# EasyEDA Pro project EasyEDA NeuroHab Core Project.epro

# Schematic Relay Schem
Create Date: 2026-04-01; Page Name: P1; Project Name: NH-AI CORE; Schematic Name: Relay Schem; Update Date: 2026-04-01; Company: EasyEDA.com; Page Size: A4; Version: V1.0
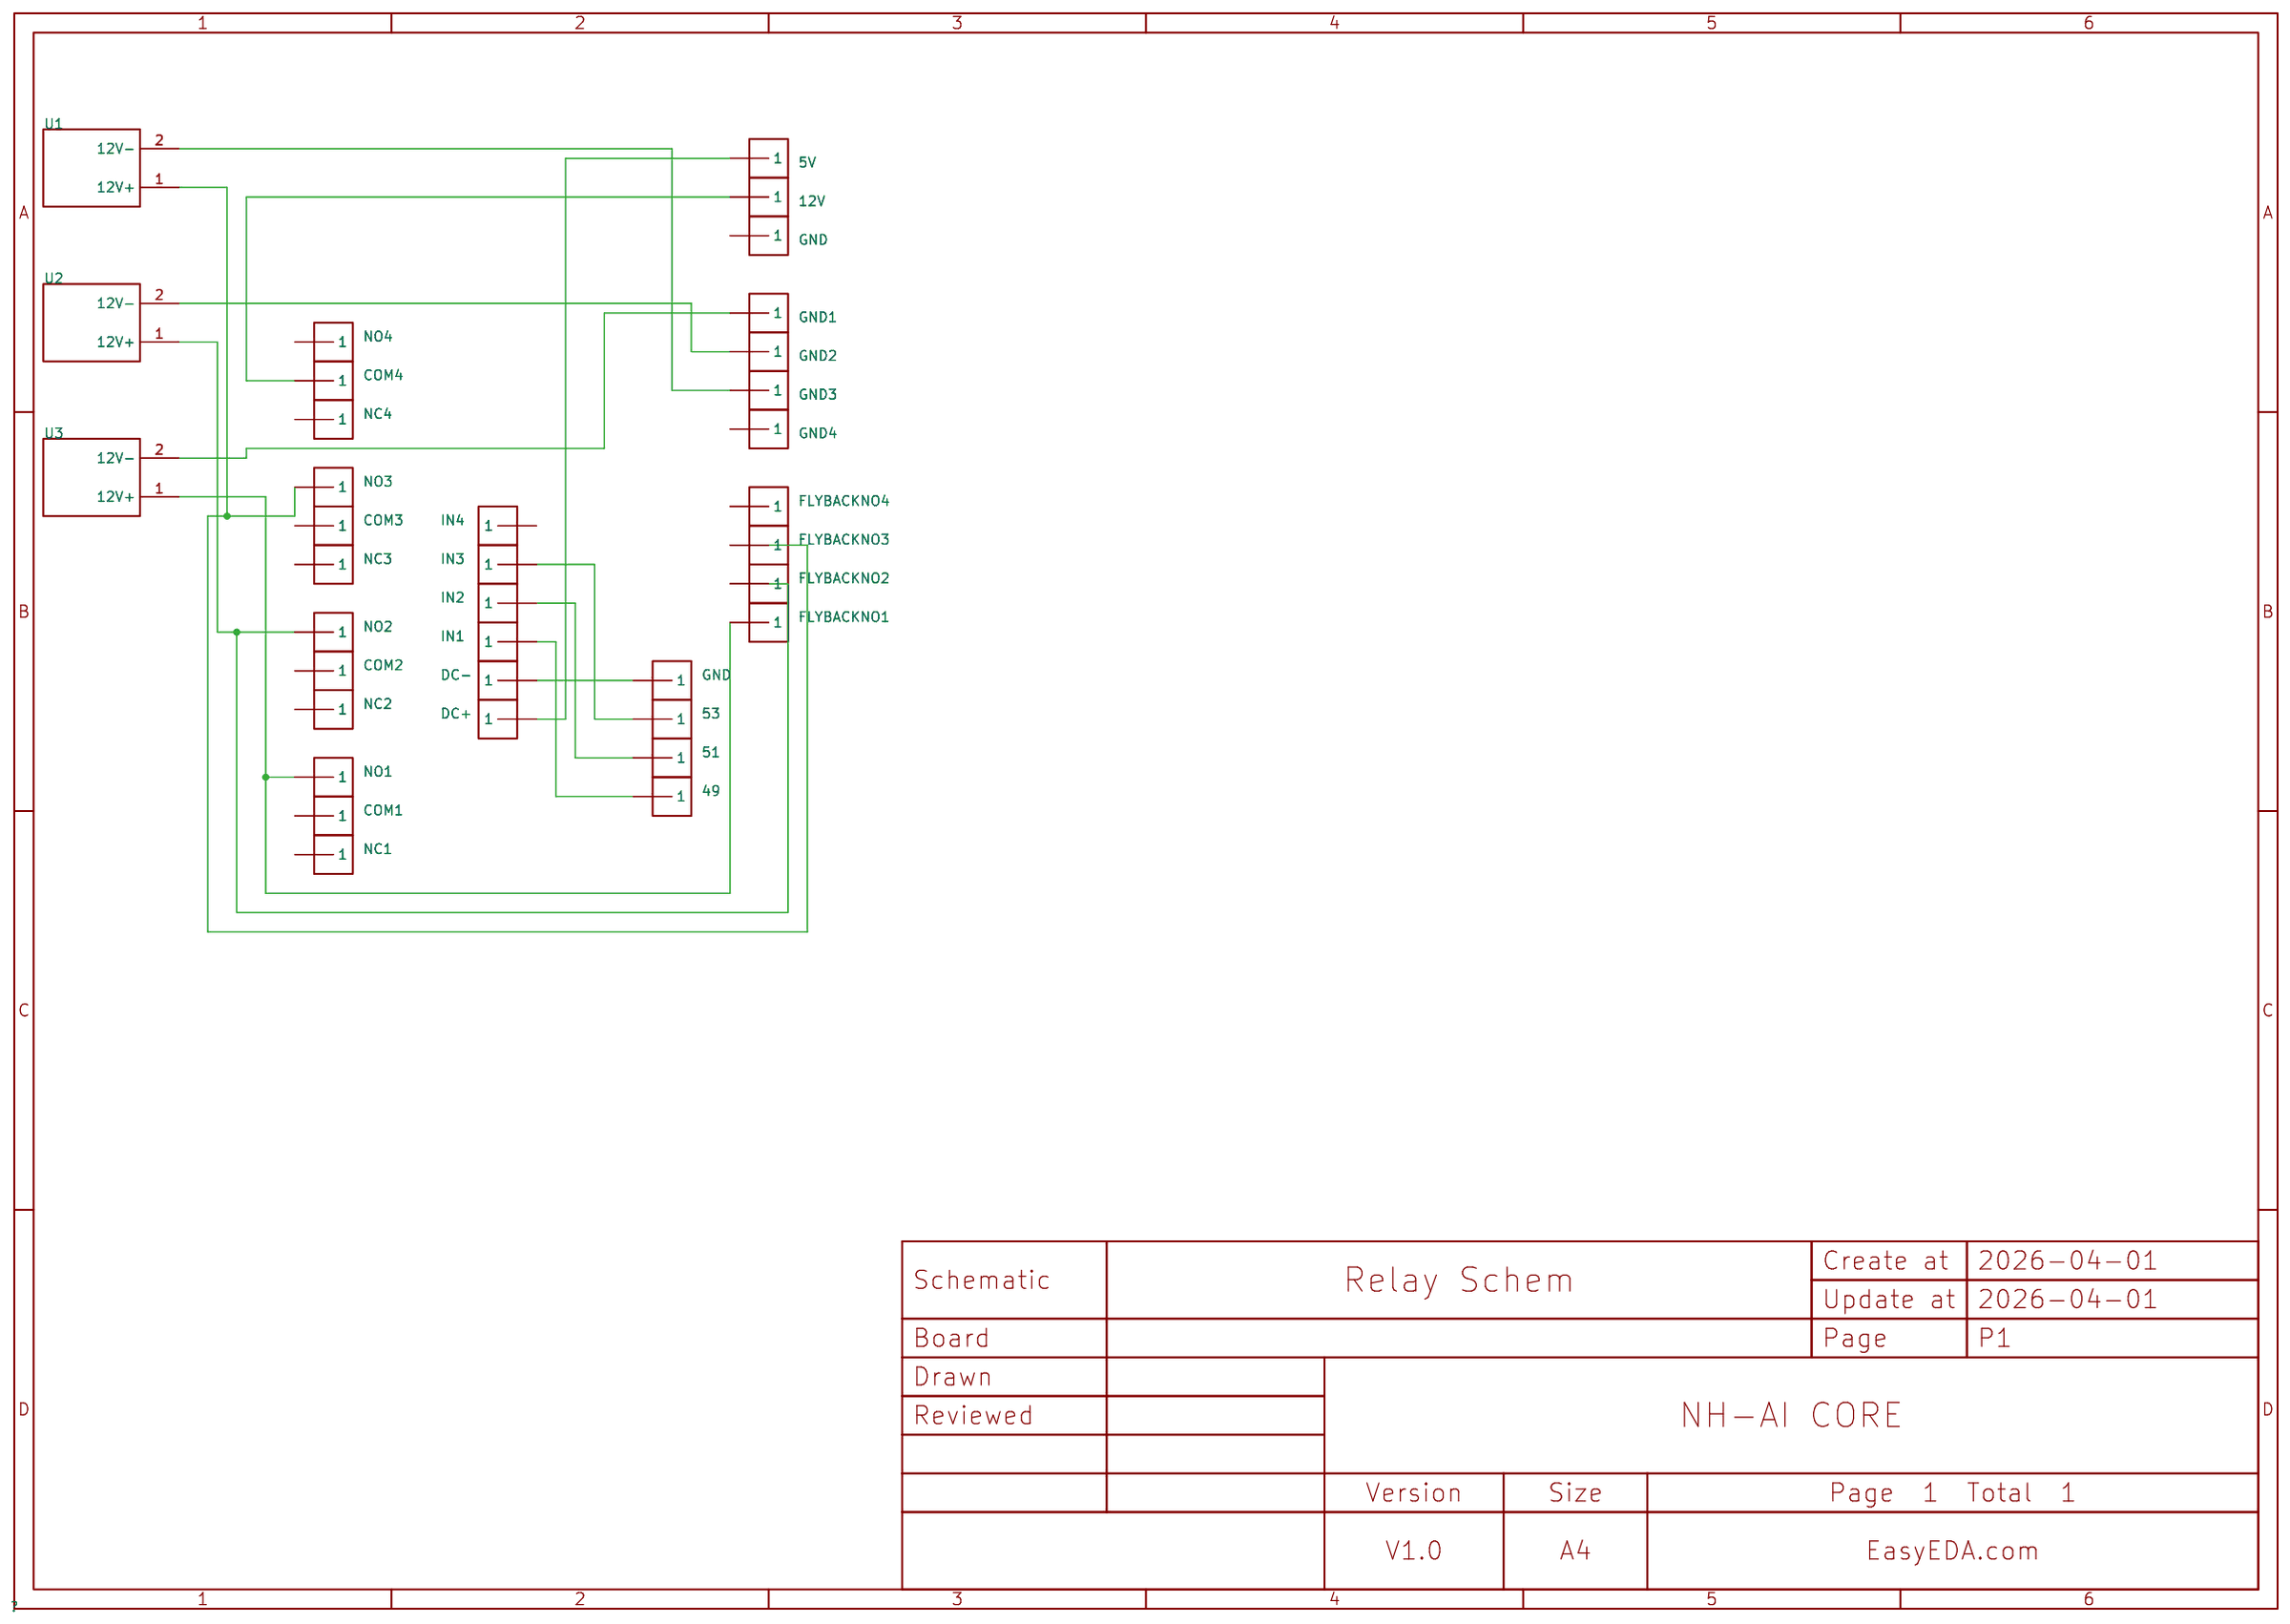
[diagram p0: schematic sheet]

## Parts
5V  -  [2.54mm Screw Terminal]
12V  -  [2.54mm Screw Terminal]
49  -  [2.54mm Screw Terminal]
51  -  [2.54mm Screw Terminal]
53  -  [2.54mm Screw Terminal]
COM1  -  [2.54mm Screw Terminal]
COM2  -  [2.54mm Screw Terminal]
COM3  -  [2.54mm Screw Terminal]
COM4  -  [2.54mm Screw Terminal]
DC+  -  [2.54mm Screw Terminal]
DC-  -  [2.54mm Screw Terminal]
FLYBACKNO1  -  [2.54mm Screw Terminal]
FLYBACKNO2  -  [2.54mm Screw Terminal]
FLYBACKNO3  -  [2.54mm Screw Terminal]
FLYBACKNO4  -  [2.54mm Screw Terminal]
GND  -  [2.54mm Screw Terminal]
GND1  -  [2.54mm Screw Terminal]
GND2  -  [2.54mm Screw Terminal]
GND3  -  [2.54mm Screw Terminal]
GND4  -  [2.54mm Screw Terminal]
GND#2  -  [2.54mm Screw Terminal]
IN1  -  [2.54mm Screw Terminal]
IN2  -  [2.54mm Screw Terminal]
IN3  -  [2.54mm Screw Terminal]
IN4  -  [2.54mm Screw Terminal]
NC1  -  [2.54mm Screw Terminal]
NC2  -  [2.54mm Screw Terminal]
NC3  -  [2.54mm Screw Terminal]
NC4  -  [2.54mm Screw Terminal]
NO1  -  [2.54mm Screw Terminal]
NO2  -  [2.54mm Screw Terminal]
NO3  -  [2.54mm Screw Terminal]
NO4  -  [2.54mm Screw Terminal]
U1  -
U2  -
U3  -

## Library data of the parts
5V 12V 49 51 53 COM1-COM4 DC+ DC- FLYBACKNO1-FLYBACKNO4 GND GND1-GND4 GND#2 IN1-IN4 NC1-NC4 NO1-NO4 = 2.54mm Screw Terminal Block
U1-U3 = 12V Solenoid Valve: +- terminals for 12V solenoid valve.

## Nets
Net-(5V-1): 5V.1 DC+.1
Net-(12V-1): 12V.1 COM4.1
Net-(49-1): 49.1 IN1.1
Net-(51-1): 51.1 IN2.1
Net-(53-1): 53.1 IN3.1
Net-(DC--1): DC-.1 GND.1
Net-(FLYBACKNO1-1): FLYBACKNO1.1 NO1.1 U3.1(12V+)
Net-(FLYBACKNO2-1): FLYBACKNO2.1 NO2.1 U2.1(12V+)
Net-(FLYBACKNO3-1): FLYBACKNO3.1 NO3.1 U1.1(12V+)
Net-(GND1-1): GND1.1 U3.2(12V-)
Net-(GND2-1): GND2.1 U2.2(12V-)
Net-(GND3-1): GND3.1 U1.2(12V-)

Not connected (* = marked no-connect by the designer): COM1 1; COM2 1; COM3 1; FLYBACKNO4 1; GND4 1; GND#2 1; IN4 1; NC1 1; NC2 1; NC3 1; NC4 1; NO4 1

# Board PCB1
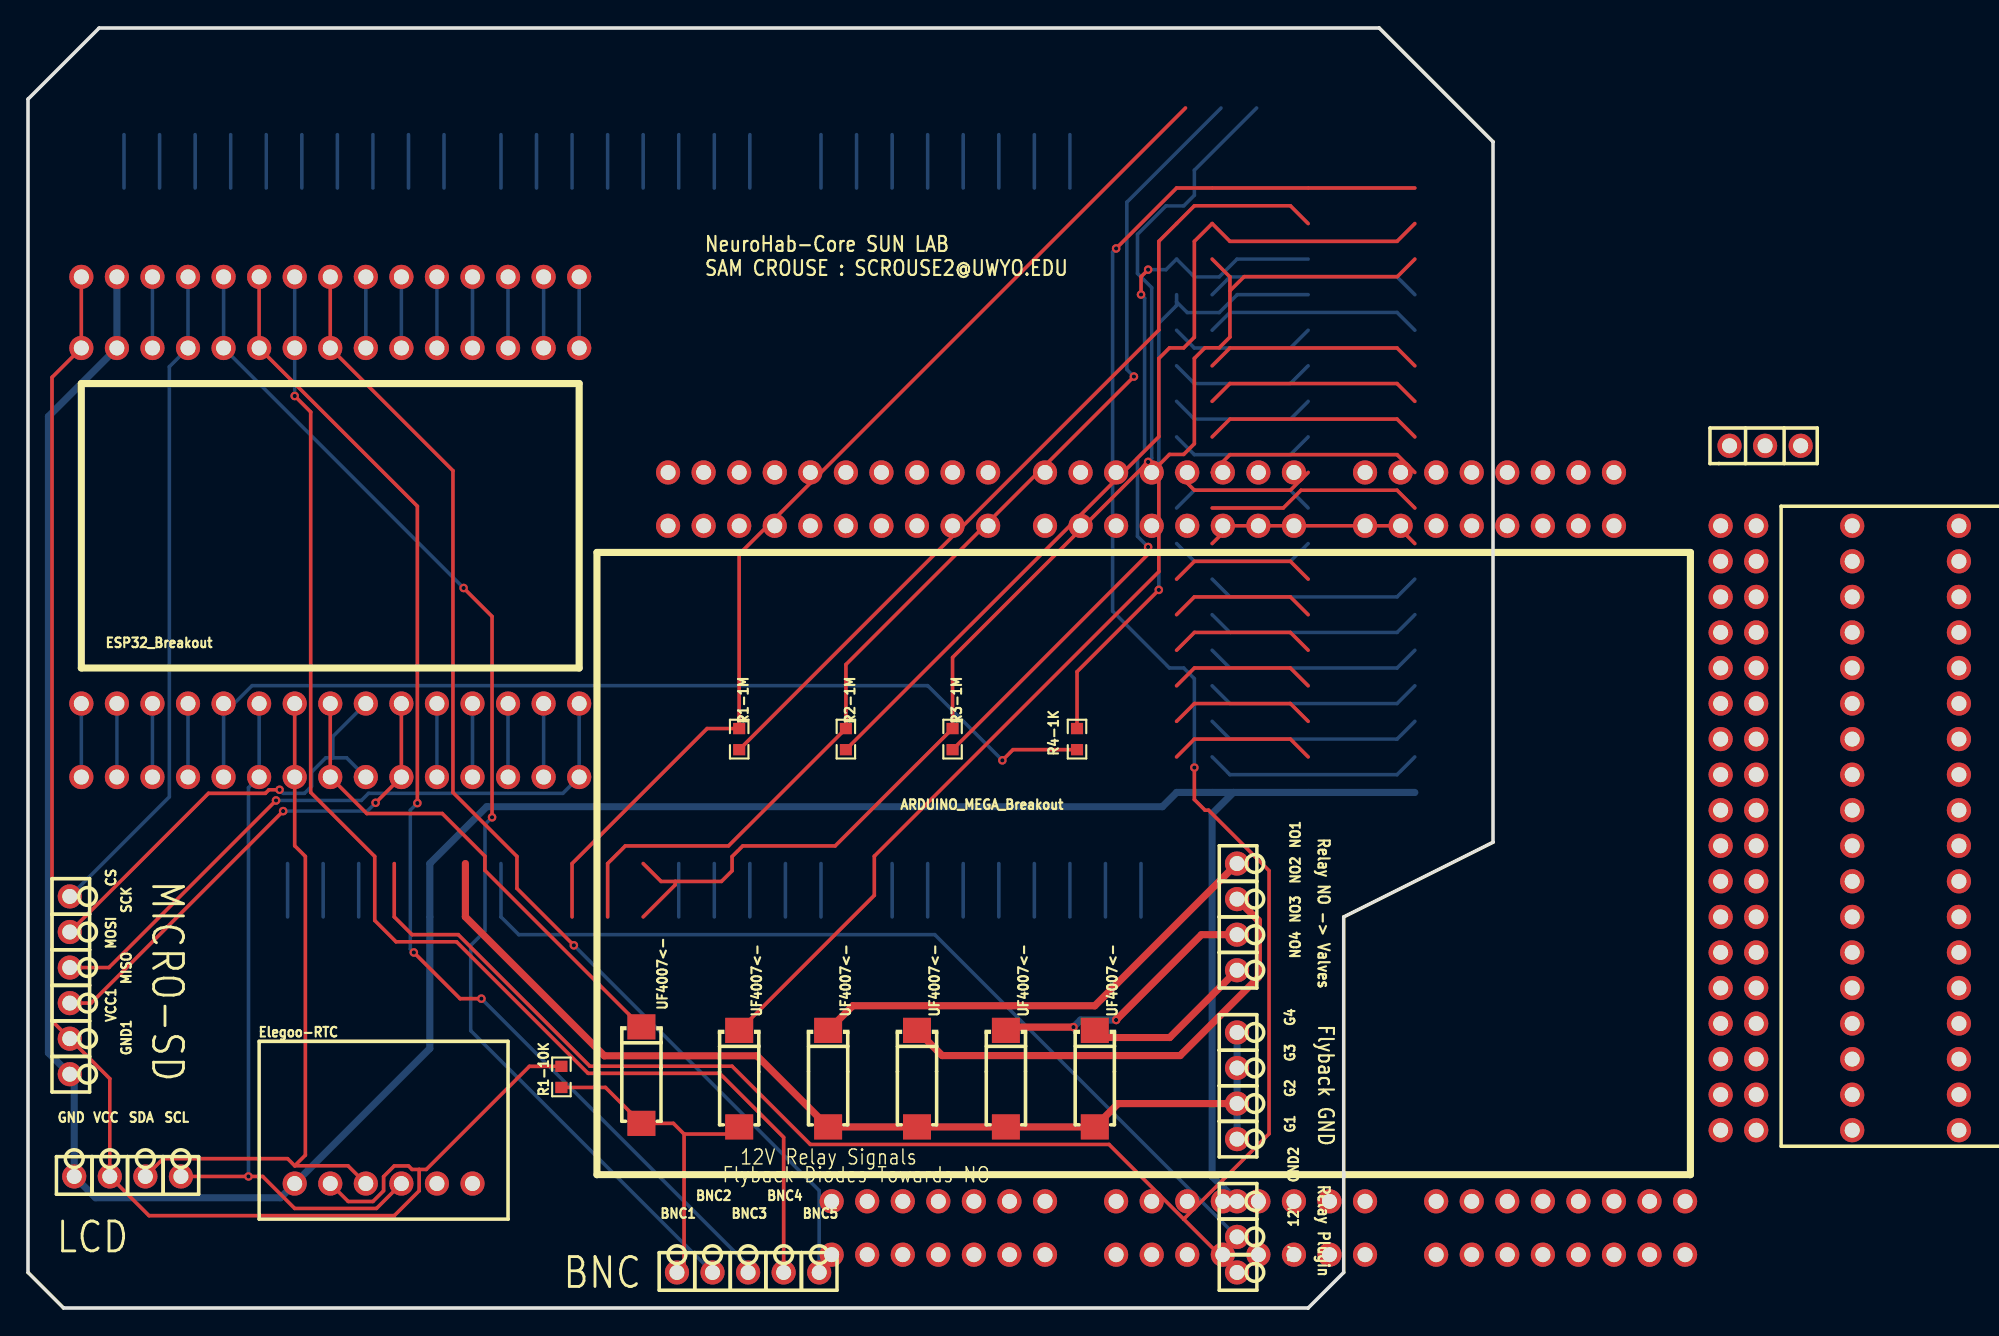
[diagram p1: board, top side]
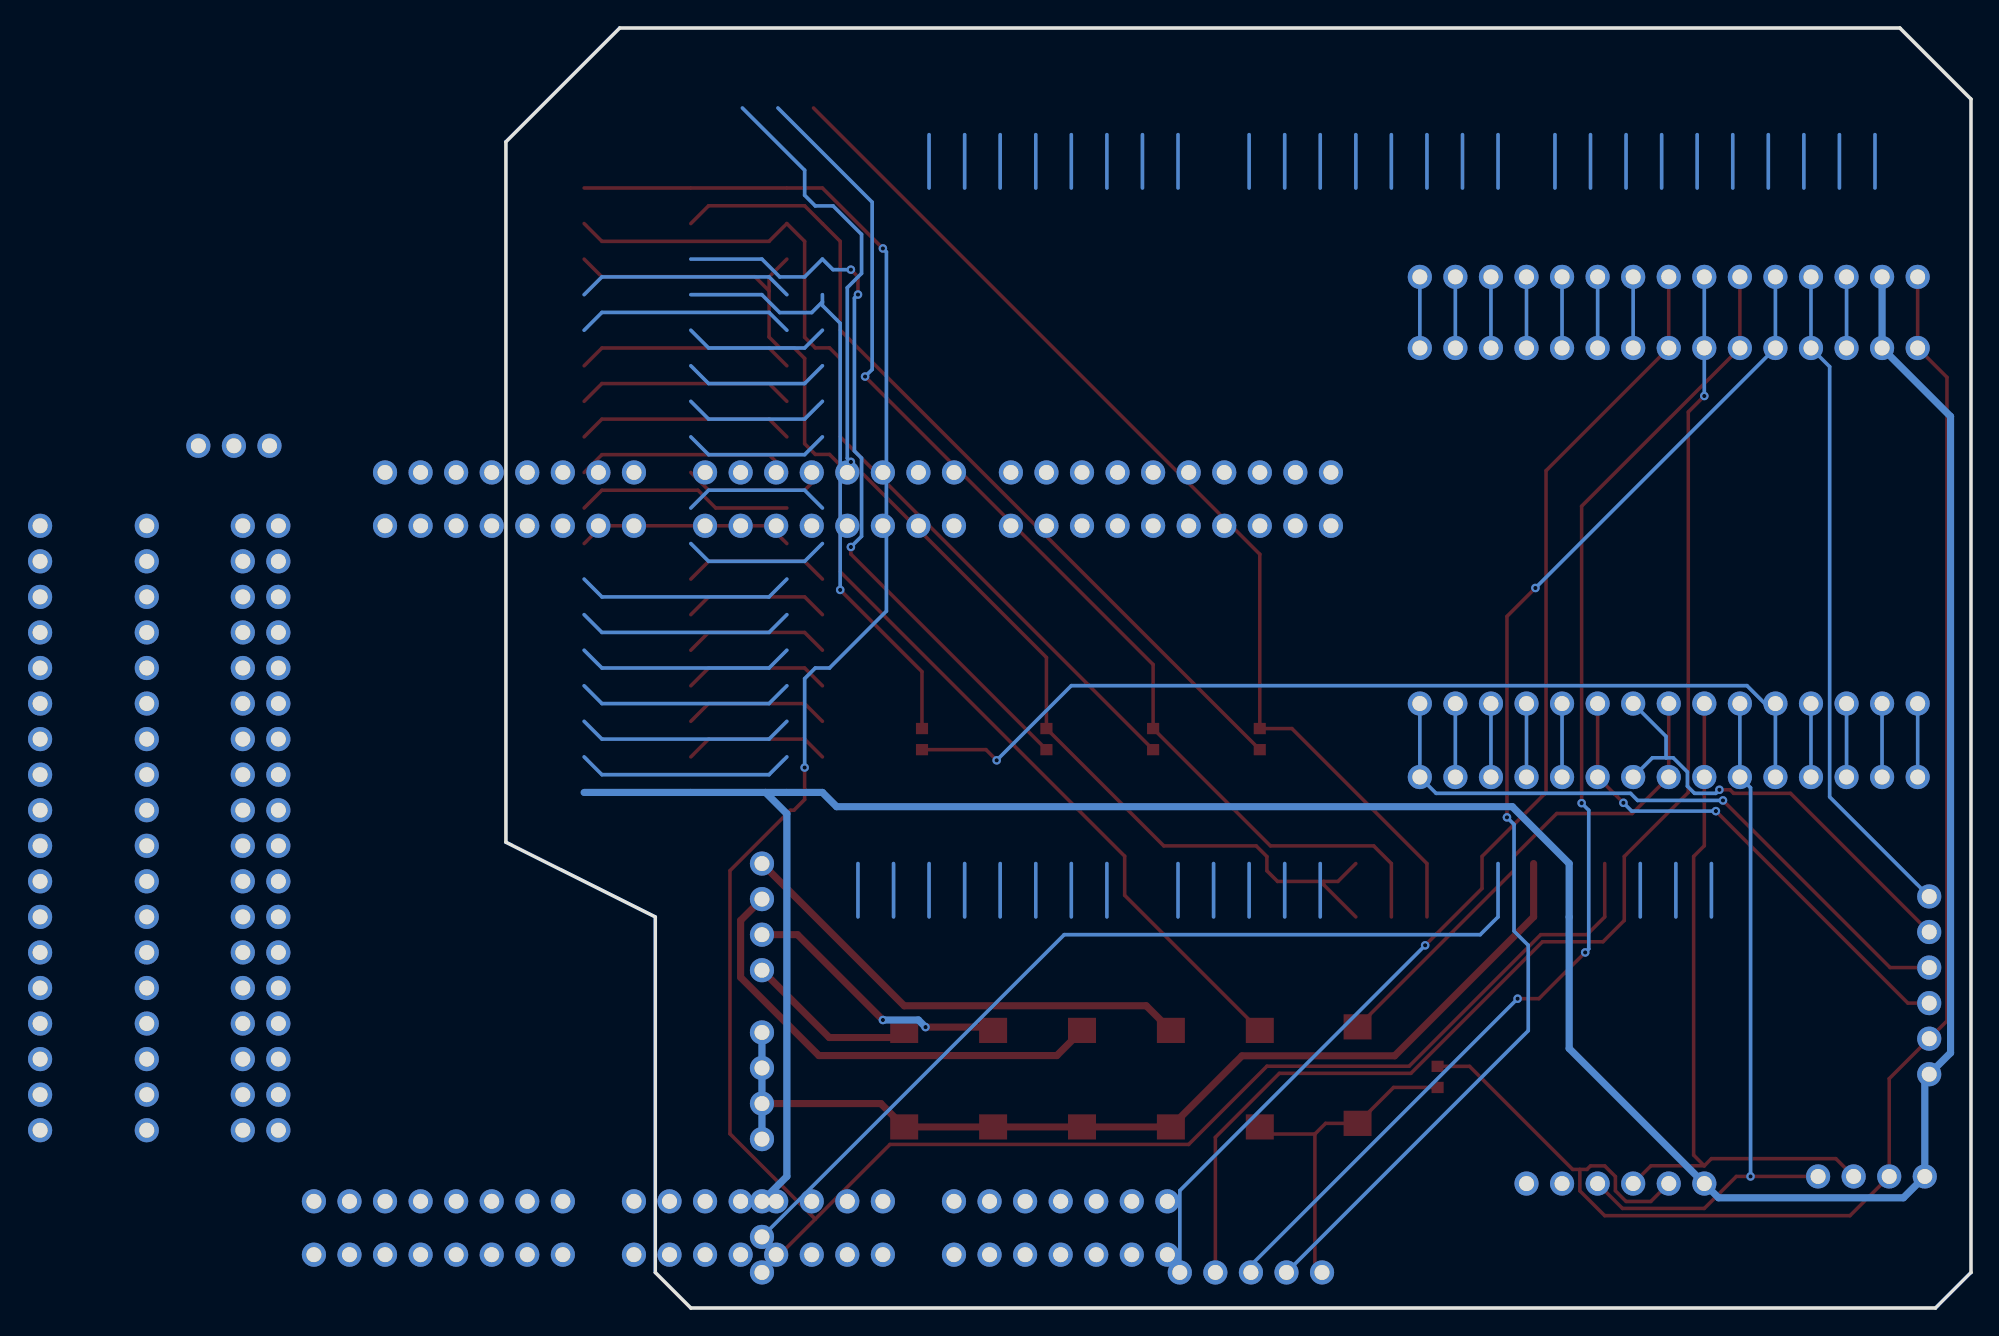
[diagram p2: board, bottom side, seen from below]

Outline 104.65 x 91.44 mm; copper layers: Top Layer, Bottom Layer. Coordinates in mm from the lower left corner of the outline.
Outline path: 0,86.36 0,2.54 2.54,0 91.44,0 93.98,2.54 93.98,27.94 104.65,33.27 104.65,83.31 96.52,91.44 5.08,91.44 0,86.36
Stack: Top Layer 0.035mm / Dielectric1 1.51mm FR4 er 4.5 / Bottom Layer 0.035mm

## Design rules (mm)
spacing copperThickness1oz (default): track to track 0.102, other pairs 0.152 to 0.3
spacing copperThickness2oz: track to track 0.203, other pairs 0.152 to 0.3
spacing Plane_innerPlane: track to track 0.102, other pairs 0.152 to 0.3
spacing Copper_copperRegion: track to track 0.102, other pairs 0.152 to 0.3
track width copperThickness1oz (default): min 0.127, default 0.254, max 2.54
track width copperThickness2oz: min 0.203, default 0.508, max 2.54
differential pair differentialPair (default): width min 0.127, default 0.254, max 2.54; gap min 0.152, default 0.152
net GND uses copperThickness2oz
net $1N12935 uses copperThickness2oz
net $1N12948 uses copperThickness2oz
net $1N12959 uses copperThickness2oz
net $1N13064 uses copperThickness2oz
net GND2 uses copperThickness2oz

## Placement (name value [footprint] x y rotation side)
5V  -  [2.54mm Screw Terminal]  86.36 2.54 270 top
12V  -  [2.54mm Screw Terminal]  86.36 5.08 270 top
ARDUINO_MEGA_Breakout  -  [Arduino Mega 2560 Breakout]  45.72 55.88 0 top
BNC1  -  [2.54mm Screw Terminal]  46.36 2.54 0 top
BNC2  -  [2.54mm Screw Terminal]  48.89 2.54 0 top
BNC3  -  [2.54mm Screw Terminal]  51.43 2.54 0 top
BNC4  -  [2.54mm Screw Terminal]  53.98 2.54 0 top
BNC5  -  [2.54mm Screw Terminal]  56.52 2.54 0 top
CS  -  [2.54mm Screw Terminal]  2.98 29.4 270 top
Elegoo-RTC  -  [Elegoo RTC DS1307]  19.05 8.89 0 top
ESP32_Breakout  -  [ESP32 Breakout]  3.81 68.58 0 top
G1  -  [2.54mm Screw Terminal]  86.36 12.06 270 top
G2  -  [2.54mm Screw Terminal]  86.36 14.6 270 top
G3  -  [2.54mm Screw Terminal]  86.36 17.14 270 top
G4  -  [2.54mm Screw Terminal]  86.36 19.69 270 top
GND  -  [2.54mm Screw Terminal]  3.3 9.4 0 top
GND1  -  [2.54mm Screw Terminal]  2.98 16.7 270 top
GND2  -  [2.54mm Screw Terminal]  86.36 7.62 270 top
MISO  -  [2.54mm Screw Terminal]  2.98 21.78 270 top
MOSI  -  [2.54mm Screw Terminal]  2.98 24.32 270 top
NO1  -  [2.54mm Screw Terminal]  86.36 31.75 270 top
NO2  -  [2.54mm Screw Terminal]  86.36 29.21 270 top
NO3  -  [2.54mm Screw Terminal]  86.36 26.67 270 top
NO4  -  [2.54mm Screw Terminal]  86.36 24.13 270 top
R1-1M  1MΩ  [R0603]  50.8 40.64 270 top
R1-10K  10K  [R0603]  38.1 16.51 90 top
R2-1M  1MΩ  [R0603]  58.42 40.64 270 top
R3-1M  1MΩ  [R0603]  66.04 40.64 270 top
R4-1K  1K  [R0603]  74.93 40.64 270 top
SCK  -  [2.54mm Screw Terminal]  2.98 26.86 270 top
SCL  -  [2.54mm Screw Terminal]  10.92 9.4 0 top
SDA  -  [2.54mm Screw Terminal]  8.38 9.4 0 top
UF4007<-  -  [SMAF_L3.5-W2.6-LS4.6-RD]  43.82 18.03 270 top
UF4007<-#2  -  [SMAF_L3.5-W2.6-LS4.6-RD]  50.8 17.78 270 top
UF4007<-#3  -  [SMAF_L3.5-W2.6-LS4.6-RD]  69.85 17.78 270 top
UF4007<-#4  -  [SMAF_L3.5-W2.6-LS4.6-RD]  63.5 17.78 270 top
UF4007<-#5  -  [SMAF_L3.5-W2.6-LS4.6-RD]  57.15 17.78 270 top
UF4007<-#6  -  [SMAF_L3.5-W2.6-LS4.6-RD]  76.2 17.78 270 top
VCC  -  [2.54mm Screw Terminal]  5.84 9.4 0 top
VCC1  -  [2.54mm Screw Terminal]  2.98 19.24 270 top

## Footprints (pads in the part's own frame, mm; a bottom-side part is the same pattern mirrored in y, then rotated)
2.54mm Screw Terminal
  round 1.727 hole 1.067: 1(0,0)
Arduino Mega 2560 Breakout
  round 1.727 hole 1.067: 1(0,0) 2(2.54,0) 3(5.08,0) 4(7.62,0) 5(10.16,0) 6(12.7,0) 7(15.24,0) 8(17.78,0) 9(20.32,0) 10(22.86,0) 11(26.924,0) 12(29.464,0) 13(32.004,0) 14(34.544,0) 15(37.084,0) 16(39.624,0) 17(42.164,0) 18(44.704,0) 19(49.784,0) 20(52.324,0) 21(54.864,0) 22(57.404,0) 23(59.944,0) 24(62.484,0) 25(65.024,0) 26(67.564,0) 27(75.184,0) 28(77.724,0) 29(75.184,-2.54) 30(77.724,-2.54) 31(75.184,-5.08) 32(77.724,-5.08) 33(75.184,-7.62) 34(77.724,-7.62) 35(75.184,-10.16) 36(77.724,-10.16) 37(75.184,-12.7) 38(77.724,-12.7) 39(75.184,-15.24) 40(77.724,-15.24) 41(75.184,-17.78) 42(77.724,-17.78) 43(75.184,-20.32) 44(77.724,-20.32) 45(75.184,-22.86) 46(77.724,-22.86) 47(75.184,-25.4) 48(77.724,-25.4) 49(75.184,-27.94) 50(77.724,-27.94) 51(75.184,-30.48) 52(77.724,-30.48) 53(75.184,-33.02) 54(77.724,-33.02) 55(75.184,-35.56) 56(77.724,-35.56) 57(75.184,-38.1) 58(77.724,-38.1) 59(75.184,-40.64) 60(77.724,-40.64) 61(75.184,-43.18) 62(77.724,-43.18) 63(72.644,-48.26) 64(70.104,-48.26) 65(67.564,-48.26) 66(65.024,-48.26) 67(62.484,-48.26) 68(59.944,-48.26) 69(57.404,-48.26) 70(54.864,-48.26) 71(49.784,-48.26) 72(47.244,-48.26) 73(44.704,-48.26) 74(42.164,-48.26) 75(39.624,-48.26) 76(37.084,-48.26) 77(34.544,-48.26) 78(32.004,-48.26) 79(26.924,-48.26) 80(24.384,-48.26) 81(21.844,-48.26) 82(19.304,-48.26) 83(16.764,-48.26) 84(14.224,-48.26) 85(11.684,-48.26) 86(75.819,5.715) 87(78.359,5.715) 88(80.899,5.715) 89(84.582,0) 90(84.582,-2.54) 91(84.582,-5.08) 92(84.582,-7.62) 93(84.582,-10.16) 94(84.582,-12.7) 95(84.582,-15.24) 96(84.582,-17.78) 97(84.582,-20.32) 98(84.582,-22.86) 99(84.582,-25.4) 100(84.582,-27.94) 101(84.582,-30.48) 102(84.582,-33.02) 103(84.582,-35.56) 104(84.582,-38.1) 105(84.582,-40.64) 106(84.582,-43.18) 107(92.202,0) 108(92.202,-2.54) 109(92.202,-5.08) 110(92.202,-7.62) 111(92.202,-10.16) 112(92.202,-12.7) 113(92.202,-15.24) 114(92.202,-17.78) 115(92.202,-20.32) 116(92.202,-22.86) 117(92.202,-25.4) 118(92.202,-27.94) 119(92.202,-30.48) 120(92.202,-33.02) 121(92.202,-35.56) 122(92.202,-38.1) 123(92.202,-40.64) 124(92.202,-43.18) 125(0,3.81) 126(2.54,3.81) 127(5.08,3.81) 128(7.62,3.81) 129(10.16,3.81) 130(12.7,3.81) 131(15.24,3.81) 132(17.78,3.81) 133(20.32,3.81) 134(22.86,3.81) 135(26.924,3.81) 136(29.464,3.81) 137(32.004,3.81) 138(34.544,3.81) 139(37.084,3.81) 140(39.624,3.81) 141(42.164,3.81) 142(44.704,3.81) 143(49.784,3.81) 144(52.324,3.81) 145(54.864,3.81) 146(57.404,3.81) 147(59.944,3.81) 148(62.484,3.81) 149(65.024,3.81) 150(67.564,3.81) 151(72.644,-52.07) 152(70.104,-52.07) 153(67.564,-52.07) 154(65.024,-52.07) 155(62.484,-52.07) 156(59.944,-52.07) 157(57.404,-52.07) 158(54.864,-52.07) 159(49.784,-52.07) 160(47.244,-52.07) 161(44.704,-52.07) 162(42.164,-52.07) 163(39.624,-52.07) 164(37.084,-52.07) 165(34.544,-52.07) 166(32.004,-52.07) 167(26.924,-52.07) 168(24.384,-52.07) 169(21.844,-52.07) 170(19.304,-52.07) 171(16.764,-52.07) 172(14.224,-52.07) 173(11.684,-52.07)
Elegoo RTC DS1307
  round 1.727 hole 1.067: 1(0,0) 2(2.54,0) 3(5.08,0) 4(7.62,0) 5(10.16,0) 6(12.7,0)
ESP32 Breakout
  round 1.727 hole 1.067: 1(0,0) 2(2.54,0) 3(5.08,0) 4(7.62,0) 5(10.16,0) 6(12.7,0) 7(15.24,0) 8(17.78,0) 9(20.32,0) 10(22.86,0) 11(25.4,0) 12(27.94,0) 13(30.48,0) 14(33.02,0) 15(35.56,0) 16(0,-25.4) 17(2.54,-25.4) 18(5.08,-25.4) 19(7.62,-25.4) 20(10.16,-25.4) 21(12.7,-25.4) 22(15.24,-25.4) 23(17.78,-25.4) 24(20.32,-25.4) 25(22.86,-25.4) 26(25.4,-25.4) 27(27.94,-25.4) 28(30.48,-25.4) 29(33.02,-25.4) 30(35.56,-25.4) 31(0,5.08) 32(2.54,5.08) 33(5.08,5.08) 34(7.62,5.08) 35(10.16,5.08) 36(12.7,5.08) 37(15.24,5.08) 38(17.78,5.08) 39(20.32,5.08) 40(22.86,5.08) 41(25.4,5.08) 42(27.94,5.08) 43(30.48,5.08) 44(33.02,5.08) 45(35.56,5.08) 46(0,-30.649) 47(2.54,-30.649) 48(5.08,-30.649) 49(7.62,-30.649) 50(10.16,-30.649) 51(12.7,-30.649) 52(15.24,-30.649) 53(17.78,-30.649) 54(20.32,-30.649) 55(22.86,-30.649) 56(25.4,-30.649) 57(27.94,-30.649) 58(30.48,-30.649) 59(33.02,-30.649) 60(35.56,-30.649)
R0603
  rect 0.806x0.864 smd: 1(-0.753,0) 2(0.753,0)
SMAF_L3.5-W2.6-LS4.6-RD
  rect 1.8x2 smd: 1(-2.05,0) 2(4.844,0)

## Nets
5V: 5V.1 ARDUINO_MEGA_Breakout.27 ARDUINO_MEGA_Breakout.28 ARDUINO_MEGA_Breakout.82 ARDUINO_MEGA_Breakout.89 ARDUINO_MEGA_Breakout.107 ARDUINO_MEGA_Breakout.170
GND: ARDUINO_MEGA_Breakout.61 ARDUINO_MEGA_Breakout.62 ARDUINO_MEGA_Breakout.81 ARDUINO_MEGA_Breakout.106 ARDUINO_MEGA_Breakout.124 ARDUINO_MEGA_Breakout.169 Elegoo-RTC.1 ESP32_Breakout.2 ESP32_Breakout.32 GND.1 GND1.1 GND2.1
GND2: ARDUINO_MEGA_Breakout.80 ARDUINO_MEGA_Breakout.168 G1.1 G2.1 G3.1 G4.1 UF4007<-#3.2 UF4007<-#4.2 UF4007<-#5.2 UF4007<-#6.2
VIN: 12V.1 ARDUINO_MEGA_Breakout.79 ARDUINO_MEGA_Breakout.167
22: ARDUINO_MEGA_Breakout.29 ARDUINO_MEGA_Breakout.90 R1-1M.2
23: ARDUINO_MEGA_Breakout.30 ARDUINO_MEGA_Breakout.108 R2-1M.2
24: ARDUINO_MEGA_Breakout.31 ARDUINO_MEGA_Breakout.91 R3-1M.2
25: ARDUINO_MEGA_Breakout.32 ARDUINO_MEGA_Breakout.109 UF4007<-#2.1
26: ARDUINO_MEGA_Breakout.33 ARDUINO_MEGA_Breakout.92 R4-1K.1
27: ARDUINO_MEGA_Breakout.34 ARDUINO_MEGA_Breakout.110
28: ARDUINO_MEGA_Breakout.35 ARDUINO_MEGA_Breakout.93
29: ARDUINO_MEGA_Breakout.36 ARDUINO_MEGA_Breakout.111
30: ARDUINO_MEGA_Breakout.37 ARDUINO_MEGA_Breakout.94
31: ARDUINO_MEGA_Breakout.38 ARDUINO_MEGA_Breakout.112
32: ARDUINO_MEGA_Breakout.39 ARDUINO_MEGA_Breakout.95
33: ARDUINO_MEGA_Breakout.40 ARDUINO_MEGA_Breakout.113
34: ARDUINO_MEGA_Breakout.41 ARDUINO_MEGA_Breakout.96
35: ARDUINO_MEGA_Breakout.42 ARDUINO_MEGA_Breakout.114
36: ARDUINO_MEGA_Breakout.43 ARDUINO_MEGA_Breakout.97
37: ARDUINO_MEGA_Breakout.44 ARDUINO_MEGA_Breakout.115
38: ARDUINO_MEGA_Breakout.45 ARDUINO_MEGA_Breakout.98
39: ARDUINO_MEGA_Breakout.46 ARDUINO_MEGA_Breakout.116
40: ARDUINO_MEGA_Breakout.47 ARDUINO_MEGA_Breakout.99
41: ARDUINO_MEGA_Breakout.48 ARDUINO_MEGA_Breakout.117
42: ARDUINO_MEGA_Breakout.49 ARDUINO_MEGA_Breakout.100
43: ARDUINO_MEGA_Breakout.50 ARDUINO_MEGA_Breakout.118
44: ARDUINO_MEGA_Breakout.51 ARDUINO_MEGA_Breakout.101
45: ARDUINO_MEGA_Breakout.52 ARDUINO_MEGA_Breakout.119
46: ARDUINO_MEGA_Breakout.53 ARDUINO_MEGA_Breakout.102
47: ARDUINO_MEGA_Breakout.54 ARDUINO_MEGA_Breakout.120
48: ARDUINO_MEGA_Breakout.55 ARDUINO_MEGA_Breakout.103
49: ARDUINO_MEGA_Breakout.56 ARDUINO_MEGA_Breakout.121
50: ARDUINO_MEGA_Breakout.57 ARDUINO_MEGA_Breakout.104
51: ARDUINO_MEGA_Breakout.58 ARDUINO_MEGA_Breakout.122
52: ARDUINO_MEGA_Breakout.59 ARDUINO_MEGA_Breakout.105
53: ARDUINO_MEGA_Breakout.60 ARDUINO_MEGA_Breakout.123
A0: ARDUINO_MEGA_Breakout.78 ARDUINO_MEGA_Breakout.86 ARDUINO_MEGA_Breakout.166 R1-1M.1
A1: ARDUINO_MEGA_Breakout.77 ARDUINO_MEGA_Breakout.87 ARDUINO_MEGA_Breakout.165 R2-1M.1
A2: ARDUINO_MEGA_Breakout.76 ARDUINO_MEGA_Breakout.88 ARDUINO_MEGA_Breakout.164 R3-1M.1
D4: ESP32_Breakout.20 ESP32_Breakout.50 R4-1K.2
D5: ESP32_Breakout.23 ESP32_Breakout.53 UF4007<-.1
D12: CS.1 ESP32_Breakout.4 ESP32_Breakout.34
D14: BNC2.1 ESP32_Breakout.5 ESP32_Breakout.35
D18: ESP32_Breakout.24 ESP32_Breakout.54 SCK.1
D19: ESP32_Breakout.25 ESP32_Breakout.55 MISO.1
D23: ESP32_Breakout.30 ESP32_Breakout.60 MOSI.1
D25: BNC5.1 ESP32_Breakout.8 ESP32_Breakout.38
D26: BNC4.1 ESP32_Breakout.7 ESP32_Breakout.37
D27: BNC3.1 ESP32_Breakout.6 ESP32_Breakout.36
ESP32-VIN: Elegoo-RTC.2 ESP32_Breakout.1 ESP32_Breakout.31 R1-10K.2 VCC.1 VCC1.1
ESP-RX2: Elegoo-RTC.4 ESP32_Breakout.21 ESP32_Breakout.51 SCL.1
ESP-TX2: Elegoo-RTC.3 ESP32_Breakout.22 ESP32_Breakout.52 SDA.1
$1N8702: Elegoo-RTC.5
$1N9596: BNC1.1 R1-10K.1 UF4007<-.2 UF4007<-#2.2
$1N12414: Elegoo-RTC.6
$1N12935: NO1.1 UF4007<-#5.1
$1N12948: NO2.1 UF4007<-#4.1
$1N12959: NO3.1 UF4007<-#3.1
$1N13064: NO4.1 UF4007<-#6.1
$1N19762: ARDUINO_MEGA_Breakout.1 ARDUINO_MEGA_Breakout.125
$1N19766: ARDUINO_MEGA_Breakout.2 ARDUINO_MEGA_Breakout.126
$1N19771: ARDUINO_MEGA_Breakout.3 ARDUINO_MEGA_Breakout.127
$1N19776: ARDUINO_MEGA_Breakout.4 ARDUINO_MEGA_Breakout.128
$1N19781: ARDUINO_MEGA_Breakout.5 ARDUINO_MEGA_Breakout.129
$1N19792: ARDUINO_MEGA_Breakout.6 ARDUINO_MEGA_Breakout.130
$1N19796: ARDUINO_MEGA_Breakout.7 ARDUINO_MEGA_Breakout.131
$1N19801: ARDUINO_MEGA_Breakout.8 ARDUINO_MEGA_Breakout.132
$1N19806: ARDUINO_MEGA_Breakout.9 ARDUINO_MEGA_Breakout.133
$1N19811: ARDUINO_MEGA_Breakout.10 ARDUINO_MEGA_Breakout.134
$1N19816: ARDUINO_MEGA_Breakout.11 ARDUINO_MEGA_Breakout.135
$1N19821: ARDUINO_MEGA_Breakout.12 ARDUINO_MEGA_Breakout.136
$1N19826: ARDUINO_MEGA_Breakout.13 ARDUINO_MEGA_Breakout.137
$1N19831: ARDUINO_MEGA_Breakout.14 ARDUINO_MEGA_Breakout.138
$1N19836: ARDUINO_MEGA_Breakout.15 ARDUINO_MEGA_Breakout.139
$1N19841: ARDUINO_MEGA_Breakout.16 ARDUINO_MEGA_Breakout.140
$1N19846: ARDUINO_MEGA_Breakout.17 ARDUINO_MEGA_Breakout.141
$1N19851: ARDUINO_MEGA_Breakout.18 ARDUINO_MEGA_Breakout.142
$1N19856: ARDUINO_MEGA_Breakout.19 ARDUINO_MEGA_Breakout.143
$1N19861: ARDUINO_MEGA_Breakout.20 ARDUINO_MEGA_Breakout.144
$1N19866: ARDUINO_MEGA_Breakout.21 ARDUINO_MEGA_Breakout.145
$1N19871: ARDUINO_MEGA_Breakout.22 ARDUINO_MEGA_Breakout.146
$1N19876: ARDUINO_MEGA_Breakout.23 ARDUINO_MEGA_Breakout.147
$1N19881: ARDUINO_MEGA_Breakout.24 ARDUINO_MEGA_Breakout.148
$1N19886: ARDUINO_MEGA_Breakout.25 ARDUINO_MEGA_Breakout.149
$1N19891: ARDUINO_MEGA_Breakout.26 ARDUINO_MEGA_Breakout.150
$1N19896: ARDUINO_MEGA_Breakout.63 ARDUINO_MEGA_Breakout.151
$1N19900: ARDUINO_MEGA_Breakout.64 ARDUINO_MEGA_Breakout.152
$1N19905: ARDUINO_MEGA_Breakout.65 ARDUINO_MEGA_Breakout.153
$1N19910: ARDUINO_MEGA_Breakout.66 ARDUINO_MEGA_Breakout.154
$1N19915: ARDUINO_MEGA_Breakout.67 ARDUINO_MEGA_Breakout.155
$1N19920: ARDUINO_MEGA_Breakout.68 ARDUINO_MEGA_Breakout.156
$1N19925: ARDUINO_MEGA_Breakout.69 ARDUINO_MEGA_Breakout.157
$1N19930: ARDUINO_MEGA_Breakout.70 ARDUINO_MEGA_Breakout.158
$1N19935: ARDUINO_MEGA_Breakout.71 ARDUINO_MEGA_Breakout.159
$1N19960: ARDUINO_MEGA_Breakout.72 ARDUINO_MEGA_Breakout.160
$1N19964: ARDUINO_MEGA_Breakout.73 ARDUINO_MEGA_Breakout.161
$1N19969: ARDUINO_MEGA_Breakout.74 ARDUINO_MEGA_Breakout.162
$1N19974: ARDUINO_MEGA_Breakout.75 ARDUINO_MEGA_Breakout.163
$1N19997: ARDUINO_MEGA_Breakout.85 ARDUINO_MEGA_Breakout.173
$1N20001: ARDUINO_MEGA_Breakout.84 ARDUINO_MEGA_Breakout.172
$1N20006: ARDUINO_MEGA_Breakout.83 ARDUINO_MEGA_Breakout.171
$1N20087: ESP32_Breakout.16 ESP32_Breakout.46
$1N20091: ESP32_Breakout.17 ESP32_Breakout.47
$1N20096: ESP32_Breakout.18 ESP32_Breakout.48
$1N20101: ESP32_Breakout.19 ESP32_Breakout.49
$1N20154: ESP32_Breakout.26 ESP32_Breakout.56
$1N20159: ESP32_Breakout.27 ESP32_Breakout.57
$1N20174: ESP32_Breakout.28 ESP32_Breakout.58
$1N20178: ESP32_Breakout.29 ESP32_Breakout.59
$1N20191: ESP32_Breakout.15 ESP32_Breakout.45
$1N20196: ESP32_Breakout.14 ESP32_Breakout.44
$1N20201: ESP32_Breakout.13 ESP32_Breakout.43
$1N20206: ESP32_Breakout.12 ESP32_Breakout.42
$1N20211: ESP32_Breakout.11 ESP32_Breakout.41
$1N20216: ESP32_Breakout.10 ESP32_Breakout.40
$1N20221: ESP32_Breakout.9 ESP32_Breakout.39
$1N20266: ESP32_Breakout.3 ESP32_Breakout.33

## Via types
v1: diameter 0.61, hole 0.305, Top Layer to Bottom Layer, 23 vias

## Routing (per net, layer and track width the routed paths; a pad name or vN(x,y) marks a point on that pad's centre or on a via; arc(x,y) is an arc through that point)
5V: length 175
  Top Layer w0.254: v1(77.72,75.69) 82.04,80.01 99.06,80.01 ; 26.16,31.75 26.16,27.94 27.43,26.67 30.73,26.67 40.13,17.27 50.29,17.27 55.88,11.68 77.22,11.68 82.55,6.35 ; 82.55,6.35 5V.1 ; 82.55,6.35 88.65,12.45 88.65,31.24 84.33,35.56 84.07,35.56 83.31,36.32 v1(83.31,38.61)
  Bottom Layer w0.254: v1(77.72,75.69) 77.47,75.44 77.47,49.78 81.53,45.72 82.55,45.72 83.31,44.96 v1(83.31,38.61)
GND: length 213.7
  Bottom Layer w0.508: 86.11,36.83 82.04,36.83 81.03,35.81 32.77,35.81 28.7,31.75 28.7,18.54 Elegoo-RTC.1 18.03,7.87 4.83,7.87 GND.1 3.3,16.38 GND1.1 1.46,18.22 1.46,63.69 ESP32_Breakout.2 ESP32_Breakout.32 ; 86.11,36.83 99.06,36.83 ; 86.11,36.83 84.58,35.31 84.58,9.4 GND2.1
GND2: length 73.5
  Top Layer w0.508: G2.1 77.87,14.6 UF4007<-#6.2 UF4007<-#3.2 UF4007<-#4.2 UF4007<-#5.2 52.07,18.02 41.17,18.02 31.24,27.94 31.24,31.75
  Bottom Layer w0.508: G4.1 G3.1 G2.1 G1.1
VIN: length 65.9
  Bottom Layer w0.254: 33.78,31.75 33.78,27.94 35.05,26.67 64.77,26.67 12V.1
22: length 61
  Top Layer w0.254: R1-1M.2 80.77,69.86 80.77,76.2 83.31,78.74 90.17,78.74 91.44,77.47
23: length 64.5
  Top Layer w0.254: R2-1M.2 80.77,62.24 80.77,67.83 81.53,68.59 82.55,68.59 83.31,69.35 83.31,76.2 84.58,77.47 85.85,76.2 97.79,76.2 99.06,77.47
24: length 53.7
  Top Layer w0.254: v1(79.5,72.4) 79.5,73.67 v1(80.01,74.18) ; v1(80.01,54.36) 80.01,53.86 R3-1M.2
  Bottom Layer w0.254: v1(79.5,72.4) 79.76,72.14 79.76,61.22 79.25,60.71 79.25,55.13 v1(80.01,54.36) ; v1(80.01,74.18) 81.29,74.18 82.04,74.93 83.31,73.66 85.09,73.66 86.36,74.93 91.44,74.93
25: length 85.5
  Top Layer w0.254: 85.85,72.66 85.85,69.36 85.09,68.6 84.07,68.6 83.31,67.84 83.31,61.74 82.55,60.98 81.53,60.98 80.77,60.22 80.77,52.6 60.45,32.28 60.45,29.48 UF4007<-#2.1 ; 85.85,72.66 85.85,73.66 84.58,74.93 ; 85.85,72.66 86.87,73.68 97.81,73.68 99.06,74.93
26: length 44.2
  Top Layer w0.254: v1(80.77,51.3) 74.93,45.46 R4-1K.1
  Bottom Layer w0.254: v1(80.77,51.3) 80.77,70.35 82.04,71.62 82.04,71.87 ; 82.04,71.87 82.8,71.11 85.09,71.11 86.37,72.39 91.44,72.39 ; 82.04,71.87 82.04,72.39
27: length 15.5
  Bottom Layer w0.254: 84.58,72.39 85.85,73.66 97.79,73.66 99.06,72.39
28: length 10.5
  Bottom Layer w0.254: 82.04,69.85 83.31,68.58 90.17,68.58 91.44,69.85
29: length 15.5
  Bottom Layer w0.254: 84.58,69.85 85.85,71.12 97.79,71.12 99.06,69.85
30: length 10.5
  Bottom Layer w0.254: 82.04,67.31 83.31,66.04 90.17,66.04 91.44,67.31
31: length 15.5
  Top Layer w0.254: 84.58,67.31 85.85,68.58 97.79,68.58 99.06,67.31
32: length 10.5
  Bottom Layer w0.254: 82.04,64.77 83.31,63.5 90.17,63.5 91.44,64.77
33: length 15.5
  Top Layer w0.254: 99.06,64.77 97.79,66.04 85.85,66.04 84.58,64.77
34: length 10.5
  Bottom Layer w0.254: 91.44,62.23 90.17,60.96 83.31,60.96 82.04,62.23
35: length 15.5
  Top Layer w0.254: 84.58,62.23 85.85,63.5 97.79,63.5 99.06,62.23
36: length 10.5
  Top Layer w0.254: 82.04,59.69 83.31,58.42 90.17,58.42 91.44,59.69
37: length 15.5
  Top Layer w0.254: 84.58,59.69 85.85,60.96 97.79,60.96 99.06,59.69
38: length 10.5
  Bottom Layer w0.254: 91.44,57.15 90.17,58.42 83.31,58.42 82.04,57.15
39: length 15.5
  Top Layer w0.254: 99.06,57.15 97.79,58.42 90.93,58.42 89.66,57.15 84.58,57.15
40: length 10.5
  Bottom Layer w0.254: 82.04,54.61 83.31,53.34 90.17,53.34 91.44,54.61
41: length 15.5
  Top Layer w0.254: 84.58,54.61 85.85,55.88 97.79,55.88 99.06,54.61
42: length 10.5
  Top Layer w0.254: 82.04,52.07 83.31,53.34 90.17,53.34 91.44,52.07
43: length 15.5
  Bottom Layer w0.254: 84.58,52.07 85.85,50.8 97.79,50.8 99.06,52.07
44: length 10.5
  Top Layer w0.254: 91.44,49.53 90.17,50.8 83.31,50.8 82.04,49.53
45: length 15.5
  Bottom Layer w0.254: 84.58,49.53 85.85,48.26 97.79,48.26 99.06,49.53
46: length 10.5
  Top Layer w0.254: 82.04,46.99 83.31,48.26 90.17,48.26 91.44,46.99
47: length 15.5
  Bottom Layer w0.254: 99.06,46.99 97.79,45.72 85.85,45.72 84.58,46.99
48: length 10.5
  Top Layer w0.254: 82.04,44.45 83.31,45.72 90.17,45.72 91.44,44.45
49: length 15.5
  Bottom Layer w0.254: 99.06,44.45 97.79,43.18 85.85,43.18 84.58,44.45
50: length 10.5
  Top Layer w0.254: 82.04,41.91 83.31,43.18 90.17,43.18 91.44,41.91
51: length 15.5
  Bottom Layer w0.254: 99.06,41.91 97.79,40.64 85.85,40.64 84.58,41.91
52: length 10.5
  Top Layer w0.254: 91.44,39.37 90.17,40.64 83.31,40.64 82.04,39.37
53: length 15.5
  Bottom Layer w0.254: 84.58,39.37 85.85,38.1 97.79,38.1 99.06,39.37
A0: length 77.3
  Top Layer w0.254: 38.86,27.94 38.86,31.75 48.51,41.39 R1-1M.1 50.8,53.85 82.68,85.72
A1: length 80.7
  Top Layer w0.254: 41.4,27.94 41.4,31.75 42.66,33.01 50.04,33.01 R2-1M.1 58.42,45.97 v1(78.99,66.54)
  Bottom Layer w0.254: v1(78.99,66.54) 78.49,67.05 78.49,78.99 85.22,85.72
A2: length 86.1
  Top Layer w0.254: 43.94,31.75 45.22,30.47 46.23,30.47 ; 43.94,27.94 46.23,30.23 46.23,30.47 ; 46.23,30.47 49.53,30.47 50.29,31.23 50.29,32.25 51.05,33.01 57.66,33.01 R3-1M.1 66.04,46.47 v1(80.01,60.44)
  Bottom Layer w0.254: 87.76,85.72 83.31,81.28 83.31,79.49 82.55,78.73 81.28,78.73 79.25,76.7 79.25,73.91 80.26,72.89 80.26,60.7 v1(80.01,60.44)
D4: length 69.4
  Top Layer w0.254: R4-1K.2 70.36,39.89 v1(69.6,39.12)
  Bottom Layer w0.254: ESP32_Breakout.50 13.97,42.43 14.48,42.93 ; 14.48,42.93 14.22,42.93 ESP32_Breakout.20 ; 14.48,42.93 16,44.46 64.26,44.46 v1(69.6,39.12)
D5: length 35.5
  Top Layer w0.254: UF4007<-.1 32.64,31.26 32.64,32.28 29.59,35.32 24.2,35.32 ESP32_Breakout.53 ESP32_Breakout.23
D12: length 47.8
  Bottom Layer w0.254: ESP32_Breakout.34 ESP32_Breakout.4 10.1,67.25 10.1,36.51 CS.1
D14: length 86.8
  Top Layer w0.254: v1(33.15,35.05) 33.15,49.4 v1(31.11,51.43)
  Bottom Layer w0.254: v1(31.11,51.43) ESP32_Breakout.5 ESP32_Breakout.35 ; BNC2.1 31.62,19.81 31.62,25.91 32.64,26.92 32.64,34.54 v1(33.15,35.05)
D18: length 32.5
  Top Layer w0.254: SCK.1 12.89,36.77 16.95,36.77 17.21,37.02 v1(17.97,37.02)
  Bottom Layer w0.254: ESP32_Breakout.24 21.78,40.83 21.78,39.31 ; 21.78,39.31 21.27,39.31 20.26,38.29 20.26,37.27 19.75,36.77 18.22,36.77 v1(17.97,37.02) ; 21.78,39.31 22.75,39.31 ESP32_Breakout.54
D19: length 35.6
  Top Layer w0.254: MISO.1 4.51,21.78 v1(18.22,35.5) ; ESP32_Breakout.25 ESP32_Breakout.55 v1(24.83,36.09)
  Bottom Layer w0.254: v1(18.22,35.5) 24.24,35.5 v1(24.83,36.09)
D23: length 47.3
  Top Layer w0.254: v1(17.72,36.26) 5.78,24.32 MOSI.1
  Bottom Layer w0.254: v1(17.72,36.26) 23.81,36.26 24.32,36.77 38.21,36.77 ESP32_Breakout.60 ESP32_Breakout.30
D25: length 85.6
  Top Layer w0.254: v1(38.99,25.91) 34.92,29.97 34.92,32.26 30.35,36.83 30.35,59.82 ESP32_Breakout.8 ESP32_Breakout.38
  Bottom Layer w0.254: BNC5.1 56.52,8.38 v1(38.99,25.91)
D26: length 93.6
  Top Layer w0.254: BNC4.1 53.98,12.19 49.4,16.76 40.01,16.76 30.61,26.16 26.29,26.16 24.77,27.69 24.77,32.26 20.19,36.83 20.19,64.01 v1(19.05,65.15)
  Bottom Layer w0.254: ESP32_Breakout.37 ESP32_Breakout.7 v1(19.05,65.15)
D27: length 86.9
  Top Layer w0.254: v1(32.39,22.1) 30.86,22.1 v1(27.56,25.4) ; ESP32_Breakout.36 ESP32_Breakout.6 27.81,57.28 v1(27.81,36.07)
  Bottom Layer w0.254: v1(27.81,36.07) 27.31,35.56 27.31,25.65 v1(27.56,25.4) ; BNC3.1 51.43,3.05 v1(32.39,22.1)
ESP32-VIN: length 114.2
  Top Layer w0.254: ESP32_Breakout.31 ESP32_Breakout.1 1.71,66.48 1.71,20.51 VCC1.1 5.84,16.38 VCC.1 8.64,6.6 26.16,6.6 27.94,8.37 27.94,9.9 ; 27.94,9.9 28.45,9.9 35.81,17.26 R1-10K.2 ; 27.94,9.9 27.43,9.9 27.18,10.15 26.16,10.15 25.4,9.39 25.4,8.37 24.64,7.61 22.87,7.61 Elegoo-RTC.2
ESP-RX2: length 51.5
  Top Layer w0.254: Elegoo-RTC.4 24.89,7.11 19.05,7.11 16.76,9.4 v1(15.75,9.4) SCL.1
  Bottom Layer w0.254: v1(15.75,9.4) 15.75,37.17 ESP32_Breakout.51 ESP32_Breakout.21
ESP-TX2: length 50.7
  Top Layer w0.254: SDA.1 9.65,10.67 18.54,10.67 19.05,10.16 ; 19.05,10.16 22.86,10.16 Elegoo-RTC.3 ; 19.05,10.16 19.81,10.92 19.81,32.26 19.05,33.02 ESP32_Breakout.52 ESP32_Breakout.22
$1N9596: length 24.4
  Top Layer w0.254: 46.86,12.43 46.1,13.19 UF4007<-.2 41.25,15.76 R1-10K.1 ; 46.86,12.43 50.29,12.43 UF4007<-#2.2 ; 46.86,12.43 46.86,3.05 BNC1.1
$1N12935: length 34.1
  Top Layer w0.508: UF4007<-#5.1 58.91,21.59 76.2,21.59 NO1.1
$1N12948: length 33.7
  Top Layer w0.508: NO2.1 87.88,27.69 87.88,23.62 82.3,18.03 65.3,18.03 UF4007<-#4.1
$1N12959: length 19.3
  Top Layer w0.508: v1(77.72,20.57) 83.82,26.67 NO3.1 ; v1(74.68,20.07) 70.09,20.07 UF4007<-#3.1
  Bottom Layer w0.508: v1(74.68,20.07) 75.18,20.57 v1(77.72,20.57)
$1N13064: length 12.4
  Top Layer w0.508: UF4007<-#6.1 76.71,19.32 81.55,19.32 NO4.1
$1N19762: length 3.8
  Bottom Layer w0.254: 6.86,80.01 6.86,83.82
$1N19766: length 3.8
  Bottom Layer w0.254: 9.4,80.01 9.4,83.82
$1N19771: length 3.8
  Bottom Layer w0.254: 11.94,80.01 11.94,83.82
$1N19776: length 3.8
  Bottom Layer w0.254: 14.48,80.01 14.48,83.82
$1N19781: length 3.8
  Bottom Layer w0.254: 17.02,80.01 17.02,83.82
$1N19792: length 3.8
  Bottom Layer w0.254: 19.56,80.01 19.56,83.82
$1N19796: length 3.8
  Bottom Layer w0.254: 22.1,80.01 22.1,83.82
$1N19801: length 3.8
  Bottom Layer w0.254: 24.64,80.01 24.64,83.82
$1N19806: length 3.8
  Bottom Layer w0.254: 27.18,80.01 27.18,83.82
$1N19811: length 3.8
  Bottom Layer w0.254: 29.72,80.01 29.72,83.82
$1N19816: length 3.8
  Bottom Layer w0.254: 33.78,80.01 33.78,83.82
$1N19821: length 3.8
  Bottom Layer w0.254: 36.32,80.01 36.32,83.82
$1N19826: length 3.8
  Bottom Layer w0.254: 38.86,80.01 38.86,83.82
$1N19831: length 3.8
  Bottom Layer w0.254: 41.4,80.01 41.4,83.82
$1N19836: length 3.8
  Bottom Layer w0.254: 43.94,80.01 43.94,83.82
$1N19841: length 3.8
  Bottom Layer w0.254: 46.48,80.01 46.48,83.82
$1N19846: length 3.8
  Bottom Layer w0.254: 49.02,80.01 49.02,83.82
$1N19851: length 3.8
  Bottom Layer w0.254: 51.56,80.01 51.56,83.82
$1N19856: length 3.8
  Bottom Layer w0.254: 56.64,80.01 56.64,83.82
$1N19861: length 3.8
  Bottom Layer w0.254: 59.18,80.01 59.18,83.82
$1N19866: length 3.8
  Bottom Layer w0.254: 61.72,80.01 61.72,83.82
$1N19871: length 3.8
  Bottom Layer w0.254: 64.26,80.01 64.26,83.82
$1N19876: length 3.8
  Bottom Layer w0.254: 66.8,80.01 66.8,83.82
$1N19881: length 3.8
  Bottom Layer w0.254: 69.34,80.01 69.34,83.82
$1N19886: length 3.8
  Bottom Layer w0.254: 71.88,80.01 71.88,83.82
$1N19891: length 3.8
  Bottom Layer w0.254: 74.42,80.01 74.42,83.82
$1N19896: length 3.8
  Bottom Layer w0.254: 79.5,31.75 79.5,27.94
$1N19900: length 3.8
  Bottom Layer w0.254: 76.96,31.75 76.96,27.94
$1N19905: length 3.8
  Bottom Layer w0.254: 74.42,31.75 74.42,27.94
$1N19910: length 3.8
  Bottom Layer w0.254: 71.88,31.75 71.88,27.94
$1N19915: length 3.8
  Bottom Layer w0.254: 69.34,31.75 69.34,27.94
$1N19920: length 3.8
  Bottom Layer w0.254: 66.8,31.75 66.8,27.94
$1N19925: length 3.8
  Bottom Layer w0.254: 64.26,31.75 64.26,27.94
$1N19930: length 3.8
  Bottom Layer w0.254: 61.72,31.75 61.72,27.94
$1N19935: length 3.8
  Bottom Layer w0.254: 56.64,31.75 56.64,27.94
$1N19960: length 3.8
  Bottom Layer w0.254: 54.1,31.75 54.1,27.94
$1N19964: length 3.8
  Bottom Layer w0.254: 51.56,31.75 51.56,27.94
$1N19969: length 3.8
  Bottom Layer w0.254: 49.02,31.75 49.02,27.94
$1N19974: length 3.8
  Bottom Layer w0.254: 46.48,31.75 46.48,27.94
$1N19997: length 3.8
  Bottom Layer w0.254: 18.54,31.75 18.54,27.94
$1N20001: length 3.8
  Bottom Layer w0.254: 21.08,31.75 21.08,27.94
$1N20006: length 3.8
  Bottom Layer w0.254: 23.62,31.75 23.62,27.94
$1N20087: length 5.2
  Bottom Layer w0.254: ESP32_Breakout.16 ESP32_Breakout.46
$1N20091: length 5.2
  Bottom Layer w0.254: ESP32_Breakout.17 ESP32_Breakout.47
$1N20096: length 5.2
  Bottom Layer w0.254: ESP32_Breakout.18 ESP32_Breakout.48
$1N20101: length 5.2
  Bottom Layer w0.254: ESP32_Breakout.19 ESP32_Breakout.49
$1N20154: length 5.2
  Bottom Layer w0.254: ESP32_Breakout.26 ESP32_Breakout.56
$1N20159: length 5.2
  Bottom Layer w0.254: ESP32_Breakout.27 ESP32_Breakout.57
$1N20174: length 5.2
  Bottom Layer w0.254: ESP32_Breakout.28 ESP32_Breakout.58
$1N20178: length 5.2
  Bottom Layer w0.254: ESP32_Breakout.29 ESP32_Breakout.59
$1N20191: length 5.1
  Bottom Layer w0.254: ESP32_Breakout.15 ESP32_Breakout.45
$1N20196: length 5.1
  Bottom Layer w0.254: ESP32_Breakout.14 ESP32_Breakout.44
$1N20201: length 5.1
  Bottom Layer w0.254: ESP32_Breakout.13 ESP32_Breakout.43
$1N20206: length 5.1
  Bottom Layer w0.254: ESP32_Breakout.12 ESP32_Breakout.42
$1N20211: length 5.1
  Bottom Layer w0.254: ESP32_Breakout.11 ESP32_Breakout.41
$1N20216: length 5.1
  Bottom Layer w0.254: ESP32_Breakout.10 ESP32_Breakout.40
$1N20221: length 5.1
  Bottom Layer w0.254: ESP32_Breakout.9 ESP32_Breakout.39
$1N20266: length 5.1
  Bottom Layer w0.254: ESP32_Breakout.3 ESP32_Breakout.33

## Text on the board
Top Silkscreen Layer: Relay NO -> Valves | Relay Plugin | Flyback Diodes Towards NO | 12V Relay Signals | NeuroHab-Core SUN LAB / SAM CROUSE : SCROUSE2@UWYO.EDU | Flyback GND | LCD | BNC | MICRO-SD
